# EAGLE schematic Regensensor (EAGLE 7.7.0)
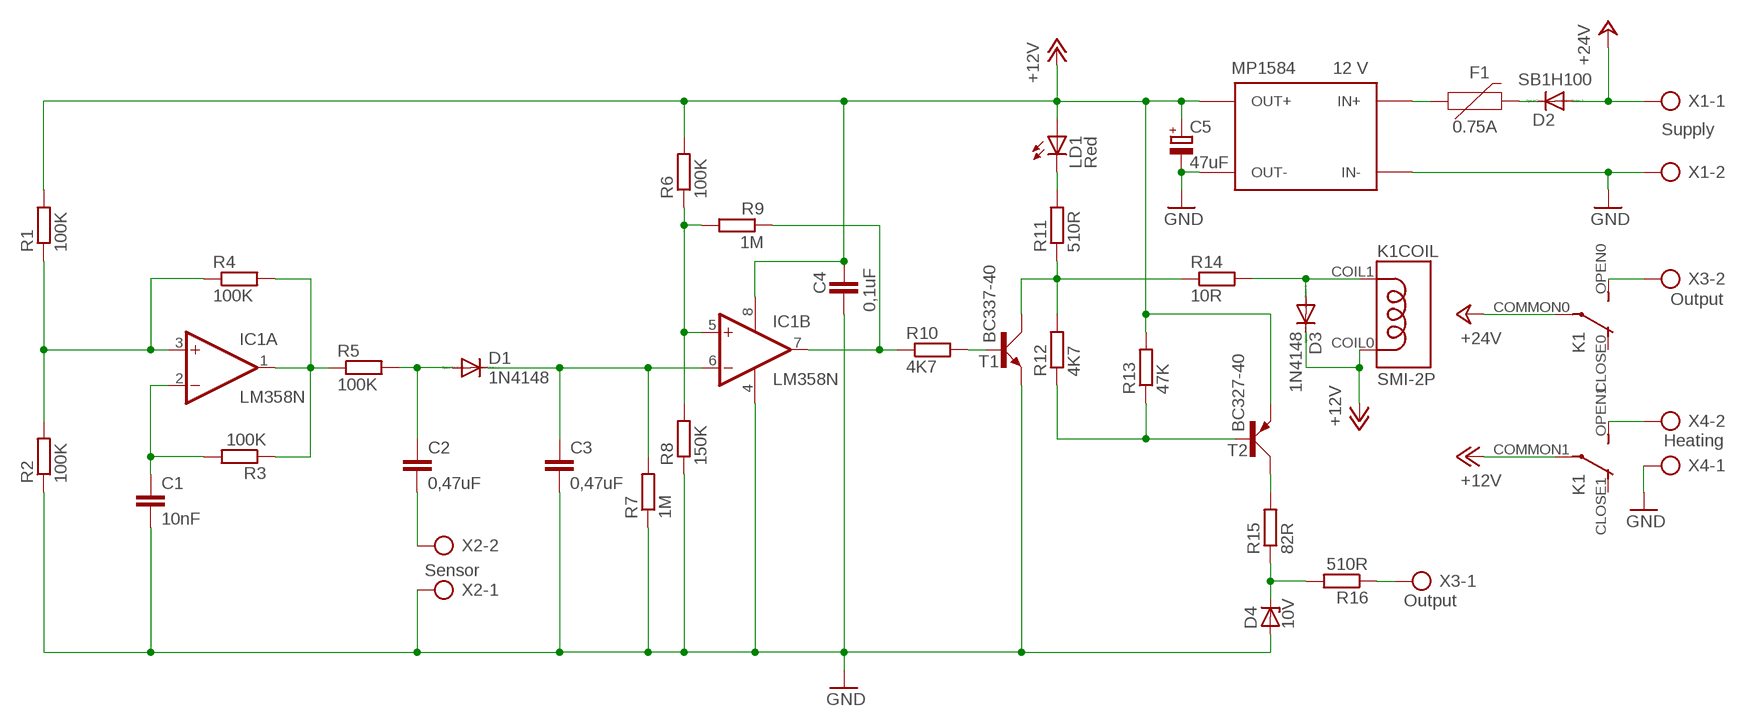
[diagram p0: schematic, sheet 1]

## Parts
C1  10nF  C-EU050-055X075  [C050-055X075]
C2  0,47uF  C-EU050-035X075  [C050-035X075]
C3  0,47uF  C-EU050-035X075  [C050-035X075]
C4  0,1uF  C-EU025-030X050  [C025-030X050]
C5  47uF  CPOL-EUE5-6  [E5-6]
D1  1N4148  1N4148DO35-2V  [DO35-2V]
D2  SB1H100  DIODE-DO41-7.6  [DO41-7.6]
D3  1N4148  1N4148DO35-7  [DO35-7]
D4  10V  ZENER-DIODEZD-2.5  [ZDIO-2.5]
F1  0.75A  PPTCRGEF250  [RGEF250]
IC1  LM358N  [DIL08]
K1  SMI-2P  [SMI]
LD1  Red  LED5MM  [LED5MM]
MP1584  12 V  DC-DC-STEP-DOWNMP1584  [MP1584]
R1  100K  R-EU_0204/2V  [0204V]
R2  100K  R-EU_0204/2V  [0204V]
R3  100K  R-EU_0204/2V  [0204V]
R4  100K  R-EU_0204/5  [0204/5]
R5  100K  R-EU_0204/2V  [0204V]
R6  100K  R-EU_0204/5  [0204/5]
R7  1M  R-EU_0204/2V  [0204V]
R8  150K  R-EU_0204/5  [0204/5]
R9  1M  R-EU_0204/5  [0204/5]
R10  4K7  R-EU_0204/5  [0204/5]
R11  510R  R-EU_0204/2V  [0204V]
R12  4K7  R-EU_0204/2V  [0204V]
R13  47K  R-EU_0204/2V  [0204V]
R14  10R  R-EU_0204/2V  [0204V]
R15  82R  R-EU_0204/2V  [0204V]
R16  510R  R-EU_0204/2V  [0204V]
T1  BC337-40  BC337LINE  [TO92-LINE]
T2  BC327-40  BC327LINE  [TO92-LINE]
X1  Supply  MKDS-3/25,08  [MKDSB-3/2-2]
X2  Sensor  MKDS-3/25,08  [MKDSB-3/2-2]
X3  Output  MKDS-3/25,08  [MKDSB-3/2-2]
X4  Heating  MKDS-3/25,08  [MKDSB-3/2-2]

## Nets
+12V: C4.1 C5.+ D3.C IC1.8(P:V+) K1.COIL0 K1.COMMON1(SWITCH1:COMMON) LD1.A MP1584.OUT+0(OUT+) MP1584.OUT+1(OUT+) R1.2 R6.2 R13.2 T2.1(E)
+24V: D2.A K1.COMMON0(SWITCH0:COMMON) X1.1
GND: C1.2 C3.2 C4.2 C5.- D4.A IC1.4(P:V-) MP1584.IN-0(IN-) MP1584.IN-1(IN-) MP1584.OUT-0(OUT-) MP1584.OUT-1(OUT-) R2.1 R7.1 R8.1 T1.1(E) X1.2 X2.1 X4.1
N$1: IC1.5(B:+IN) R6.1 R8.2 R9.2
N$2: IC1.7(B:OUT) R9.1 R10.1
N$3: C3.1 D1.C IC1.6(B:-IN) R7.2
N$4: C2.1 D1.A R5.2
N$5: R10.2 T1.2(B)
N$6: C1.1 IC1.2(A:-IN) R3.2
N$7: IC1.1(A:OUT) R3.1 R4.2 R5.1
N$8: F1.P$1 MP1584.IN+0(IN+) MP1584.IN+1(IN+)
N$9: IC1.3(A:+IN) R1.1 R2.2 R4.1
N$10: R11.1 R12.2 R14.1 T1.3(C)
N$11: R12.1 R13.1 T2.2(B)
N$12: LD1.K(C) R11.2
N$13: C2.2 X2.2
N$14: D3.A K1.COIL1 R14.2
N$15: D4.C R15.1 R16.2
N$16: K1.OPEN0(SWITCH0:OPEN) X3.2
N$17: K1.OPEN1(SWITCH1:OPEN) X4.2
N$18: D2.C F1.P$2
N$19: R15.2 T2.3(C)
N$20: R16.1 X3.1
Unconnected: K1.CLOSE0(SWITCH0:CLOSE) K1.CLOSE1(SWITCH1:CLOSE)

## Notes on the sheet
- Output

## Library data of the parts
C1-C4 = rcl:C-EU: CAPACITOR, European symbol
C5 = rcl:CPOL-EU: POLARIZED CAPACITOR, European symbol
D1 D3 = diode:1N4148: DIODE high speed (Philips)
D2 = diode:DIODE-: DIODE
D4 = diode:ZENER-DIODE: Z-Diode
F1 = ptc:PPTC: Resettable Fuse PPTC Resettable Fuse. Really a sort of resistor with a polymeric positive temperature coefficient whose resistance increases dramatically with an increase in temperature. When heated by the power passing through the resistance rises causing the current to be limited, protecting the circuit. This is achieved by the transition of the polymer from a crystalline to an amorphous state where the conductive carbon separates breaking the conductive pathways found in the cool crystalline structure. When a PPTC cools back down it resumes conducting letting the circuit turn back on.; PROD_ID: RES-08490; VALUE: 16V/2.5A
IC1 = linear:LM358: OP AMP also LM158; LM258; LM2904 Source: http://cache.national.com/ds/LM/LM158.pdf
K1 = songle:SMI-2P: Songle relay (SMI-2P) Source: http://www.songlerelay.com/Public/Uploads/20190921/5d8598d95868d.pdf
LD1 = led:LED: LED OSRAM: - CHIPLED LG R971, LG N971, LY N971, LG Q971, LY Q971, LO R971, LY R971 LH N974, LH R974 LS Q976, LO Q976, LY Q976 LO Q996 - Hyper CHIPLED LW Q18S LB Q993, LB Q99A, LB R99A - SideLED LS A670, LO A670, LY A670, LG A670, LP A670 LB A673, LV A673, LT A673, LW A673 LH A674 LY A675 LS A676, LA A676, LO A676, LY A676, LW A676 LS A679, LY A679, LG A679 - Hyper Micro SIDELED® LS Y876, LA Y876, LO Y876, LY Y876 LT Y87S - SmartLED LW L88C, LW L88S LB L89C, LB L89S, LG L890 LS L89K, LO L89K, LY L89K LS L896, LA L896, LO L896, LY L896 - TOPLED LS T670, LO T670, LY T670, LG T670, LP T670 LSG T670, LSP T670, LSY T670, LOP T670, LYG T670 LG T671, LOG T671, LSG T671 LB T673, LV T673, LT T673, LW T673 LH T674 LS T676, LA T676, LO T676, LY T676, LB T676, LH T676, LSB T676, LW T676 LB T67C, LV T67C, LT T67C, LS T67K, LO T67K, LY T67K, LW E67C LS E67B, LA E67B, LO E67B, LY E67B, LB E67C, LV E67C, LT E67C LW T67C LS T679, LY T679, LG T679 LS T770, LO T770, LY T770, LG T770, LP T770 LB T773, LV T773, LT T773, LW T773 LH T774 LS E675, LA E675, LY E675, LS T675 LS T776, LA T776, LO T776, LY T776, LB T776 LHGB T686 LT T68C, LB T68C - Hyper Mini TOPLED® LB M676 - Mini TOPLED Santana® LG M470 LS M47K, LO M47K, LY M47K Source: http://www.osram.convergy.de LUXEON: - LUMILED® LXK2-PW12-R00, LXK2-PW12-S00, LXK2-PW14-U00, LXK2-PW14-V00 LXK2-PM12-R00, LXK2-PM12-S00, LXK2-PM14-U00 LXK2-PE12-Q00, LXK2-PE12-R00, LXK2-PE12-S00, LXK2-PE14-T00, LXK2-PE14-U00 LXK2-PB12-K00, LXK2-PB12-L00, LXK2-PB12-M00, LXK2-PB14-N00, LXK2-PB14-P00, LXK2-PB14-Q00 LXK2-PR12-L00, LXK2-PR12-M00, LXK2-PR14-Q00, LXK2-PR14-R00 LXK2-PD12-Q00, LXK2-PD12-R00, LXK2-PD12-S00 LXK2-PH12-R00, LXK2-PH12-S00 LXK2-PL12-P00, LXK2-PL12-Q00, LXK2-PL12-R00 Source: www.luxeon.com KINGBRIGHT: KA-3528ASYC Source: www.kingbright.com
MP1584 = modules:DC-DC-STEP-DOWN: DC/DC Step-Down Regulator based on MP1584 chip
R1-R16 = rcl:R-EU_: RESISTOR, European symbol
T1 = transistor-small-signal:BC337: NPN TRANSISTOR
T2 = transistor-small-signal:BC327: PNP TRANSISTOR
X1-X4 = con-phoenix-mkds-3:MKDS-3/2: MKDS 3/2-508 Source: PHOENIX CONTACT

## Net classes
0 default: clearance 0.355 mm